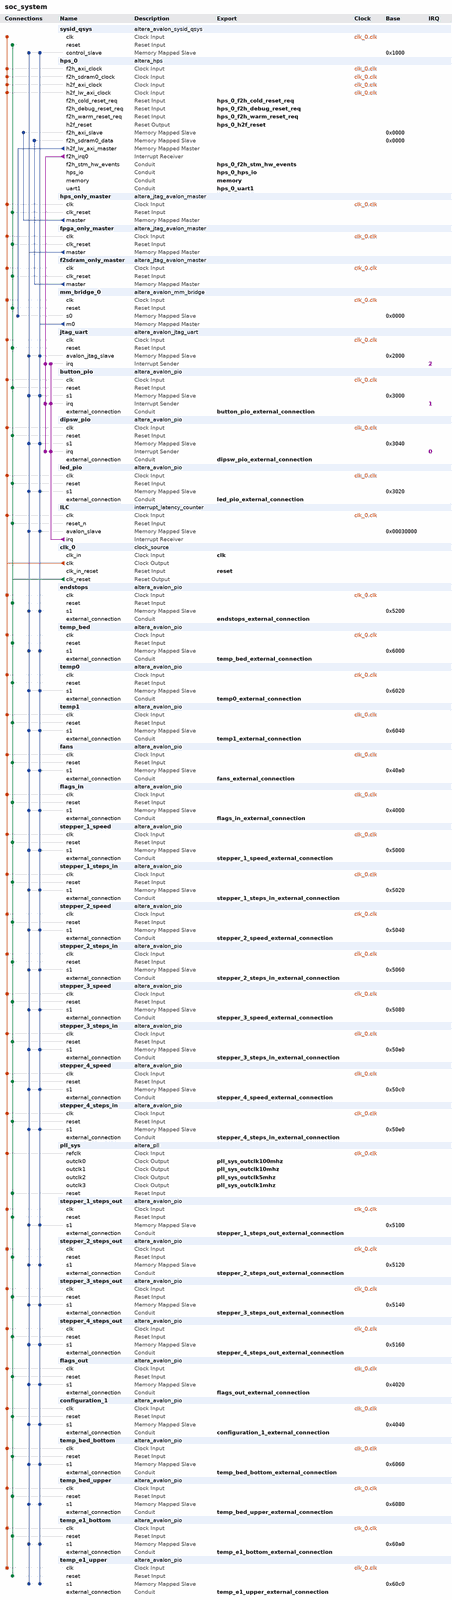
[diagram p0: system contents, whole]
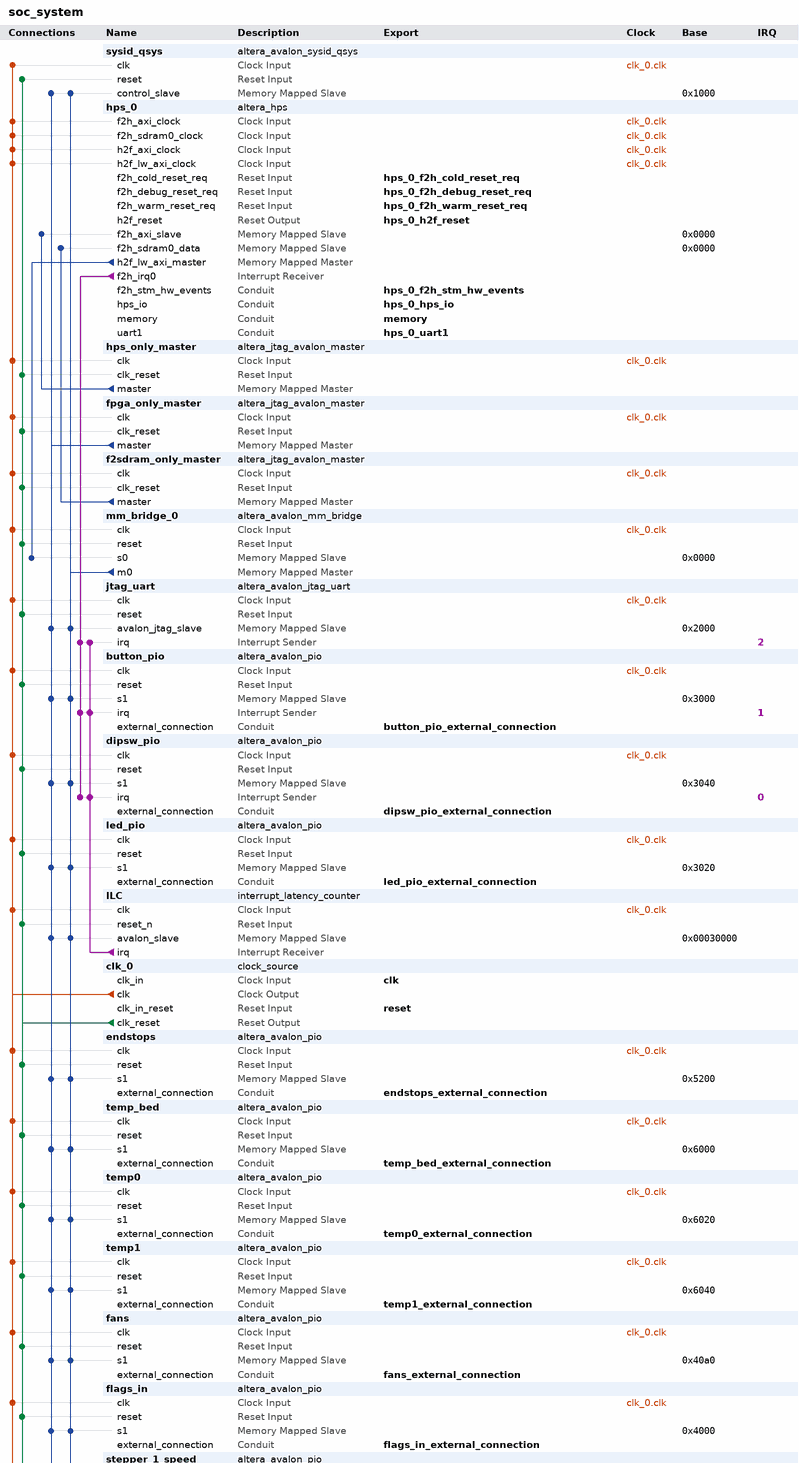
[diagram p1: system contents, upper part]
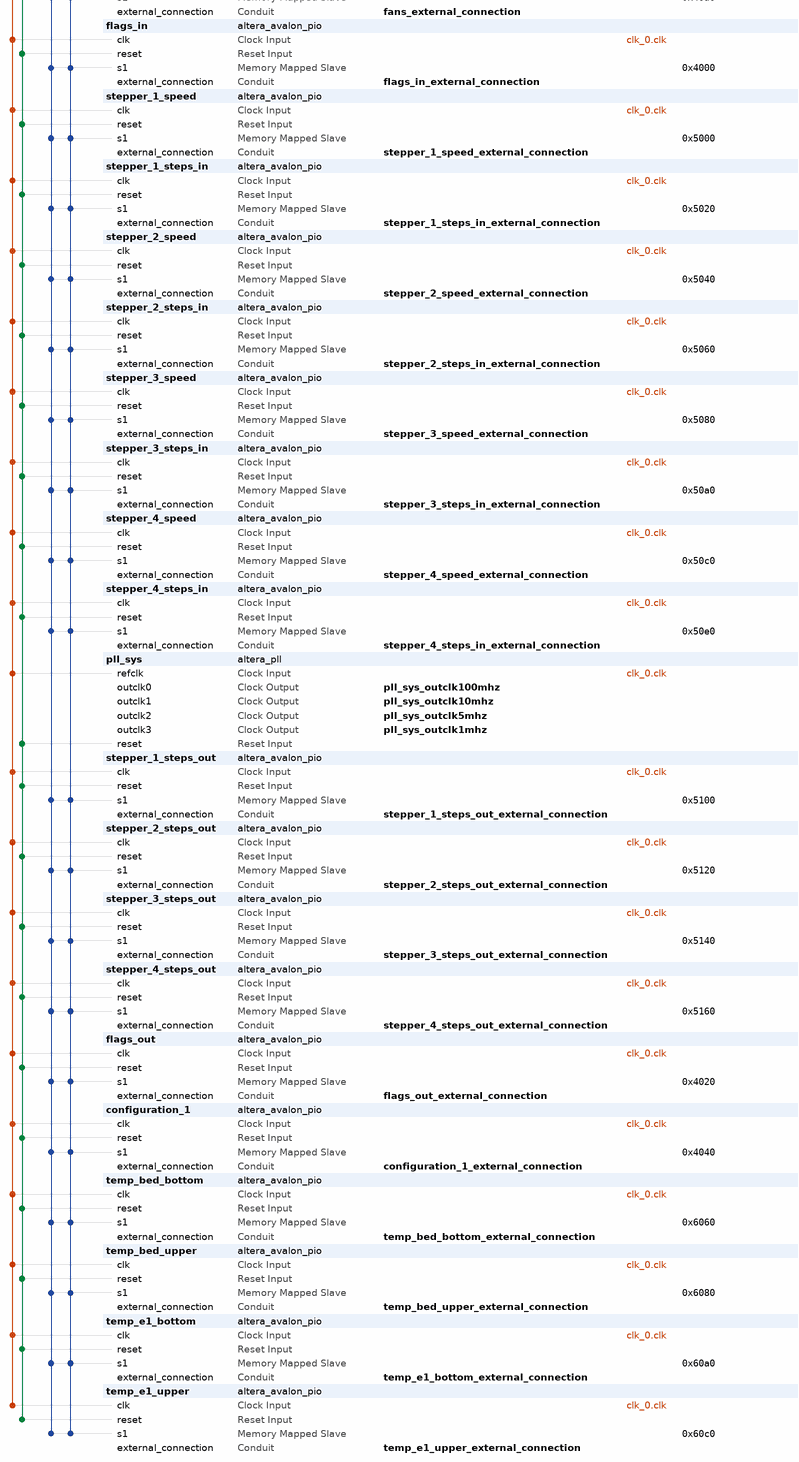
[diagram p2: system contents, lower part]
# Platform Designer (Qsys) system soc_system, Cyclone V 5CSEBA6U23I7
# Parameters at their usual value, and those the tool derives, are not listed.
package require -exact qsys 18.1
create_system soc_system
set_project_property DEVICE_FAMILY {Cyclone V}
set_project_property DEVICE 5CSEBA6U23I7

add_instance sysid_qsys altera_avalon_sysid_qsys 18.1
set_instance_parameter_value sysid_qsys id -60670

add_instance hps_0 altera_hps 18.1
set_instance_parameter_value hps_0 EMAC1_Mode RGMII
set_instance_parameter_value hps_0 EMAC1_PinMuxing {HPS I/O Set 0}
set_instance_parameter_value hps_0 F2SCLK_COLDRST_Enable true
set_instance_parameter_value hps_0 F2SCLK_DBGRST_Enable true
set_instance_parameter_value hps_0 F2SCLK_WARMRST_Enable true
set_instance_parameter_value hps_0 F2SDRAM_Type {Avalon-MM Bidirectional}
set_instance_parameter_value hps_0 F2SDRAM_Width 256
set_instance_parameter_value hps_0 F2SINTERRUPT_Enable true
set_instance_parameter_value hps_0 F2S_Width 2
set_instance_parameter_value hps_0 FPGA_PERIPHERAL_OUTPUT_CLOCK_FREQ_EMAC0_GTX_CLK 100
set_instance_parameter_value hps_0 FPGA_PERIPHERAL_OUTPUT_CLOCK_FREQ_EMAC0_MD_CLK 100.0
set_instance_parameter_value hps_0 FPGA_PERIPHERAL_OUTPUT_CLOCK_FREQ_EMAC1_GTX_CLK 100
set_instance_parameter_value hps_0 FPGA_PERIPHERAL_OUTPUT_CLOCK_FREQ_EMAC1_MD_CLK 100.0
set_instance_parameter_value hps_0 HPS_PROTOCOL DDR3
set_instance_parameter_value hps_0 I2C0_Mode I2C
set_instance_parameter_value hps_0 I2C0_PinMuxing {HPS I/O Set 0}
set_instance_parameter_value hps_0 I2C1_Mode I2C
set_instance_parameter_value hps_0 I2C1_PinMuxing {HPS I/O Set 0}
set_instance_parameter_value hps_0 LWH2F_Enable true
set_instance_parameter_value hps_0 MEM_BANKADDR_WIDTH 3
set_instance_parameter_value hps_0 MEM_CLK_FREQ 400.0
set_instance_parameter_value hps_0 MEM_COL_ADDR_WIDTH 10
set_instance_parameter_value hps_0 MEM_DQ_WIDTH 32
set_instance_parameter_value hps_0 MEM_DRV_STR RZQ/6
set_instance_parameter_value hps_0 MEM_ROW_ADDR_WIDTH 15
set_instance_parameter_value hps_0 MEM_RTT_NOM RZQ/6
set_instance_parameter_value hps_0 MEM_RTT_WR {Dynamic ODT off}
set_instance_parameter_value hps_0 MEM_TCL 7
set_instance_parameter_value hps_0 MEM_TFAW_NS 37.5
set_instance_parameter_value hps_0 MEM_TRAS_NS 35.0
set_instance_parameter_value hps_0 MEM_TRCD_NS 13.75
set_instance_parameter_value hps_0 MEM_TRFC_NS 300.0
set_instance_parameter_value hps_0 MEM_TRP_NS 13.75
set_instance_parameter_value hps_0 MEM_VENDOR Other
set_instance_parameter_value hps_0 MEM_WTCL 7
set_instance_parameter_value hps_0 QSPI_Mode N/A
set_instance_parameter_value hps_0 QSPI_PinMuxing Unused
set_instance_parameter_value hps_0 REF_CLK_FREQ 25.0
set_instance_parameter_value hps_0 S2FCLK_USER2CLK 4
set_instance_parameter_value hps_0 S2F_Width 2
set_instance_parameter_value hps_0 SDIO_Mode {4-bit Data}
set_instance_parameter_value hps_0 SDIO_PinMuxing {HPS I/O Set 0}
set_instance_parameter_value hps_0 SPIM1_Mode {Single Slave Select}
set_instance_parameter_value hps_0 SPIM1_PinMuxing {HPS I/O Set 0}
set_instance_parameter_value hps_0 STM_Enable true
set_instance_parameter_value hps_0 TIMING_BOARD_AC_SKEW 0.02
set_instance_parameter_value hps_0 TIMING_BOARD_AC_TO_CK_SKEW 0.0
set_instance_parameter_value hps_0 TIMING_BOARD_DQ_TO_DQS_SKEW 0.0
set_instance_parameter_value hps_0 TIMING_BOARD_MAX_CK_DELAY 0.6
set_instance_parameter_value hps_0 TIMING_BOARD_MAX_DQS_DELAY 0.6
set_instance_parameter_value hps_0 TIMING_BOARD_SKEW_BETWEEN_DQS 0.02
set_instance_parameter_value hps_0 TIMING_BOARD_SKEW_CKDQS_DIMM_MAX 0.01
set_instance_parameter_value hps_0 TIMING_BOARD_SKEW_CKDQS_DIMM_MIN -0.01
set_instance_parameter_value hps_0 TIMING_BOARD_SKEW_WITHIN_DQS 0.02
set_instance_parameter_value hps_0 TIMING_TDH 125
set_instance_parameter_value hps_0 TIMING_TDQSCK 400
set_instance_parameter_value hps_0 TIMING_TDQSQ 120
set_instance_parameter_value hps_0 TIMING_TDS 50
set_instance_parameter_value hps_0 TIMING_TIH 250
set_instance_parameter_value hps_0 TIMING_TIS 175
set_instance_parameter_value hps_0 TIMING_TQSH 0.38
set_instance_parameter_value hps_0 UART0_Mode {No Flow Control}
set_instance_parameter_value hps_0 UART0_PinMuxing {HPS I/O Set 0}
set_instance_parameter_value hps_0 UART1_Mode Full
set_instance_parameter_value hps_0 UART1_PinMuxing FPGA
set_instance_parameter_value hps_0 USB1_Mode SDR
set_instance_parameter_value hps_0 USB1_PinMuxing {HPS I/O Set 0}
set_instance_parameter_value hps_0 desired_cfg_clk_mhz 100.0
set_instance_parameter_value hps_0 desired_qspi_clk_mhz 370.0

add_instance hps_only_master altera_jtag_avalon_master 18.1

add_instance fpga_only_master altera_jtag_avalon_master 18.1

add_instance f2sdram_only_master altera_jtag_avalon_master 18.1

add_instance mm_bridge_0 altera_avalon_mm_bridge 18.1
set_instance_parameter_value mm_bridge_0 ADDRESS_UNITS SYMBOLS
set_instance_parameter_value mm_bridge_0 ADDRESS_WIDTH 10
set_instance_parameter_value mm_bridge_0 DATA_WIDTH 32
set_instance_parameter_value mm_bridge_0 MAX_PENDING_RESPONSES 4
set_instance_parameter_value mm_bridge_0 USE_AUTO_ADDRESS_WIDTH 1

add_instance jtag_uart altera_avalon_jtag_uart 18.1
set_instance_parameter_value jtag_uart allowMultipleConnections true
set_instance_parameter_value jtag_uart simInteractiveOptions INTERACTIVE_ASCII_OUTPUT

add_instance button_pio altera_avalon_pio 18.1
set_instance_parameter_value button_pio bitClearingEdgeCapReg true
set_instance_parameter_value button_pio captureEdge true
set_instance_parameter_value button_pio direction Input
set_instance_parameter_value button_pio edgeType FALLING
set_instance_parameter_value button_pio generateIRQ true
set_instance_parameter_value button_pio irqType EDGE
set_instance_parameter_value button_pio width 2

add_instance dipsw_pio altera_avalon_pio 18.1
set_instance_parameter_value dipsw_pio bitClearingEdgeCapReg true
set_instance_parameter_value dipsw_pio captureEdge true
set_instance_parameter_value dipsw_pio direction Input
set_instance_parameter_value dipsw_pio edgeType ANY
set_instance_parameter_value dipsw_pio generateIRQ true
set_instance_parameter_value dipsw_pio irqType EDGE
set_instance_parameter_value dipsw_pio width 4

add_instance led_pio altera_avalon_pio 18.1
set_instance_parameter_value led_pio direction Output
set_instance_parameter_value led_pio resetValue 127
set_instance_parameter_value led_pio width 7

add_instance ILC interrupt_latency_counter 18.1

add_instance clk_0 clock_source 18.1
set_instance_parameter_value clk_0 clockFrequency 50000000

add_instance endstops altera_avalon_pio 18.1
set_instance_parameter_value endstops direction Input
set_instance_parameter_value endstops width 6

add_instance temp_bed altera_avalon_pio 18.1
set_instance_parameter_value temp_bed direction Input
set_instance_parameter_value temp_bed width 12

add_instance temp0 altera_avalon_pio 18.1
set_instance_parameter_value temp0 direction Input
set_instance_parameter_value temp0 width 12

add_instance temp1 altera_avalon_pio 18.1
set_instance_parameter_value temp1 direction Input
set_instance_parameter_value temp1 width 12

add_instance fans altera_avalon_pio 18.1
set_instance_parameter_value fans direction Output
set_instance_parameter_value fans width 2

add_instance flags_in altera_avalon_pio 18.1
set_instance_parameter_value flags_in direction Input
set_instance_parameter_value flags_in width 32

add_instance stepper_1_speed altera_avalon_pio 18.1
set_instance_parameter_value stepper_1_speed direction Output
set_instance_parameter_value stepper_1_speed width 32

add_instance stepper_1_steps_in altera_avalon_pio 18.1
set_instance_parameter_value stepper_1_steps_in direction Input
set_instance_parameter_value stepper_1_steps_in width 32

add_instance stepper_2_speed altera_avalon_pio 18.1
set_instance_parameter_value stepper_2_speed direction Output
set_instance_parameter_value stepper_2_speed width 32

add_instance stepper_2_steps_in altera_avalon_pio 18.1
set_instance_parameter_value stepper_2_steps_in direction Input
set_instance_parameter_value stepper_2_steps_in width 32

add_instance stepper_3_speed altera_avalon_pio 18.1
set_instance_parameter_value stepper_3_speed direction Output
set_instance_parameter_value stepper_3_speed width 32

add_instance stepper_3_steps_in altera_avalon_pio 18.1
set_instance_parameter_value stepper_3_steps_in direction Input
set_instance_parameter_value stepper_3_steps_in width 32

add_instance stepper_4_speed altera_avalon_pio 18.1
set_instance_parameter_value stepper_4_speed direction Output
set_instance_parameter_value stepper_4_speed width 32

add_instance stepper_4_steps_in altera_avalon_pio 18.1
set_instance_parameter_value stepper_4_steps_in direction Input
set_instance_parameter_value stepper_4_steps_in width 32

add_instance pll_sys altera_pll 18.1
set_instance_parameter_value pll_sys gui_device_speed_grade 2
set_instance_parameter_value pll_sys gui_number_of_clocks 4
set_instance_parameter_value pll_sys gui_operation_mode direct
set_instance_parameter_value pll_sys gui_output_clock_frequency0 100.0
set_instance_parameter_value pll_sys gui_output_clock_frequency1 10.0
set_instance_parameter_value pll_sys gui_output_clock_frequency2 5.0
set_instance_parameter_value pll_sys gui_output_clock_frequency3 1.0
set_instance_parameter_value pll_sys gui_pll_mode {Integer-N PLL}
set_instance_parameter_value pll_sys gui_reference_clock_frequency 50.0
set_instance_parameter_value pll_sys gui_use_locked true

add_instance stepper_1_steps_out altera_avalon_pio 18.1
set_instance_parameter_value stepper_1_steps_out direction Output
set_instance_parameter_value stepper_1_steps_out width 32

add_instance stepper_2_steps_out altera_avalon_pio 18.1
set_instance_parameter_value stepper_2_steps_out direction Output
set_instance_parameter_value stepper_2_steps_out width 32

add_instance stepper_3_steps_out altera_avalon_pio 18.1
set_instance_parameter_value stepper_3_steps_out direction Output
set_instance_parameter_value stepper_3_steps_out width 32

add_instance stepper_4_steps_out altera_avalon_pio 18.1
set_instance_parameter_value stepper_4_steps_out direction Output
set_instance_parameter_value stepper_4_steps_out width 32

add_instance flags_out altera_avalon_pio 18.1
set_instance_parameter_value flags_out direction Output
set_instance_parameter_value flags_out width 32

add_instance configuration_1 altera_avalon_pio 18.1
set_instance_parameter_value configuration_1 direction Output
set_instance_parameter_value configuration_1 width 32

add_instance temp_bed_bottom altera_avalon_pio 18.1
set_instance_parameter_value temp_bed_bottom direction Output
set_instance_parameter_value temp_bed_bottom width 12

add_instance temp_bed_upper altera_avalon_pio 18.1
set_instance_parameter_value temp_bed_upper direction Output
set_instance_parameter_value temp_bed_upper width 12

add_instance temp_e1_bottom altera_avalon_pio 18.1
set_instance_parameter_value temp_e1_bottom direction Output
set_instance_parameter_value temp_e1_bottom width 12

add_instance temp_e1_upper altera_avalon_pio 18.1
set_instance_parameter_value temp_e1_upper direction Output
set_instance_parameter_value temp_e1_upper width 12

# connections
add_connection clk_0.clk button_pio.clk clock
add_connection clk_0.clk configuration_1.clk clock
add_connection clk_0.clk dipsw_pio.clk clock
add_connection clk_0.clk endstops.clk clock
add_connection clk_0.clk f2sdram_only_master.clk clock
add_connection clk_0.clk fans.clk clock
add_connection clk_0.clk flags_in.clk clock
add_connection clk_0.clk flags_out.clk clock
add_connection clk_0.clk fpga_only_master.clk clock
add_connection clk_0.clk hps_0.f2h_axi_clock clock
add_connection clk_0.clk hps_0.f2h_sdram0_clock clock
add_connection clk_0.clk hps_0.h2f_axi_clock clock
add_connection clk_0.clk hps_0.h2f_lw_axi_clock clock
add_connection clk_0.clk hps_only_master.clk clock
add_connection clk_0.clk ILC.clk clock
add_connection clk_0.clk jtag_uart.clk clock
add_connection clk_0.clk led_pio.clk clock
add_connection clk_0.clk mm_bridge_0.clk clock
add_connection clk_0.clk pll_sys.refclk clock
add_connection clk_0.clk stepper_1_speed.clk clock
add_connection clk_0.clk stepper_1_steps_in.clk clock
add_connection clk_0.clk stepper_1_steps_out.clk clock
add_connection clk_0.clk stepper_2_speed.clk clock
add_connection clk_0.clk stepper_2_steps_in.clk clock
add_connection clk_0.clk stepper_2_steps_out.clk clock
add_connection clk_0.clk stepper_3_speed.clk clock
add_connection clk_0.clk stepper_3_steps_in.clk clock
add_connection clk_0.clk stepper_3_steps_out.clk clock
add_connection clk_0.clk stepper_4_speed.clk clock
add_connection clk_0.clk stepper_4_steps_in.clk clock
add_connection clk_0.clk stepper_4_steps_out.clk clock
add_connection clk_0.clk sysid_qsys.clk clock
add_connection clk_0.clk temp0.clk clock
add_connection clk_0.clk temp1.clk clock
add_connection clk_0.clk temp_bed.clk clock
add_connection clk_0.clk temp_bed_bottom.clk clock
add_connection clk_0.clk temp_bed_upper.clk clock
add_connection clk_0.clk temp_e1_bottom.clk clock
add_connection clk_0.clk temp_e1_upper.clk clock
add_connection clk_0.clk_reset button_pio.reset reset
add_connection clk_0.clk_reset configuration_1.reset reset
add_connection clk_0.clk_reset dipsw_pio.reset reset
add_connection clk_0.clk_reset endstops.reset reset
add_connection clk_0.clk_reset f2sdram_only_master.clk_reset reset
add_connection clk_0.clk_reset fans.reset reset
add_connection clk_0.clk_reset flags_in.reset reset
add_connection clk_0.clk_reset flags_out.reset reset
add_connection clk_0.clk_reset fpga_only_master.clk_reset reset
add_connection clk_0.clk_reset hps_only_master.clk_reset reset
add_connection clk_0.clk_reset ILC.reset_n reset
add_connection clk_0.clk_reset jtag_uart.reset reset
add_connection clk_0.clk_reset led_pio.reset reset
add_connection clk_0.clk_reset mm_bridge_0.reset reset
add_connection clk_0.clk_reset pll_sys.reset reset
add_connection clk_0.clk_reset stepper_1_speed.reset reset
add_connection clk_0.clk_reset stepper_1_steps_in.reset reset
add_connection clk_0.clk_reset stepper_1_steps_out.reset reset
add_connection clk_0.clk_reset stepper_2_speed.reset reset
add_connection clk_0.clk_reset stepper_2_steps_in.reset reset
add_connection clk_0.clk_reset stepper_2_steps_out.reset reset
add_connection clk_0.clk_reset stepper_3_speed.reset reset
add_connection clk_0.clk_reset stepper_3_steps_in.reset reset
add_connection clk_0.clk_reset stepper_3_steps_out.reset reset
add_connection clk_0.clk_reset stepper_4_speed.reset reset
add_connection clk_0.clk_reset stepper_4_steps_in.reset reset
add_connection clk_0.clk_reset stepper_4_steps_out.reset reset
add_connection clk_0.clk_reset sysid_qsys.reset reset
add_connection clk_0.clk_reset temp0.reset reset
add_connection clk_0.clk_reset temp1.reset reset
add_connection clk_0.clk_reset temp_bed.reset reset
add_connection clk_0.clk_reset temp_bed_bottom.reset reset
add_connection clk_0.clk_reset temp_bed_upper.reset reset
add_connection clk_0.clk_reset temp_e1_bottom.reset reset
add_connection clk_0.clk_reset temp_e1_upper.reset reset
add_connection f2sdram_only_master.master hps_0.f2h_sdram0_data avalon
set_connection_parameter_value f2sdram_only_master.master/hps_0.f2h_sdram0_data baseAddress 0x0000
add_connection fpga_only_master.master button_pio.s1 avalon
set_connection_parameter_value fpga_only_master.master/button_pio.s1 baseAddress 0x3000
add_connection fpga_only_master.master configuration_1.s1 avalon
set_connection_parameter_value fpga_only_master.master/configuration_1.s1 baseAddress 0x4040
add_connection fpga_only_master.master dipsw_pio.s1 avalon
set_connection_parameter_value fpga_only_master.master/dipsw_pio.s1 baseAddress 0x3040
add_connection fpga_only_master.master endstops.s1 avalon
set_connection_parameter_value fpga_only_master.master/endstops.s1 baseAddress 0x5200
add_connection fpga_only_master.master fans.s1 avalon
set_connection_parameter_value fpga_only_master.master/fans.s1 baseAddress 0x40a0
add_connection fpga_only_master.master flags_in.s1 avalon
set_connection_parameter_value fpga_only_master.master/flags_in.s1 baseAddress 0x4000
add_connection fpga_only_master.master flags_out.s1 avalon
set_connection_parameter_value fpga_only_master.master/flags_out.s1 baseAddress 0x4020
add_connection fpga_only_master.master ILC.avalon_slave avalon
set_connection_parameter_value fpga_only_master.master/ILC.avalon_slave baseAddress 0x00030000
add_connection fpga_only_master.master jtag_uart.avalon_jtag_slave avalon
set_connection_parameter_value fpga_only_master.master/jtag_uart.avalon_jtag_slave baseAddress 0x2000
add_connection fpga_only_master.master led_pio.s1 avalon
set_connection_parameter_value fpga_only_master.master/led_pio.s1 baseAddress 0x3020
add_connection fpga_only_master.master stepper_1_speed.s1 avalon
set_connection_parameter_value fpga_only_master.master/stepper_1_speed.s1 baseAddress 0x5000
add_connection fpga_only_master.master stepper_1_steps_in.s1 avalon
set_connection_parameter_value fpga_only_master.master/stepper_1_steps_in.s1 baseAddress 0x5020
add_connection fpga_only_master.master stepper_1_steps_out.s1 avalon
set_connection_parameter_value fpga_only_master.master/stepper_1_steps_out.s1 baseAddress 0x5100
add_connection fpga_only_master.master stepper_2_speed.s1 avalon
set_connection_parameter_value fpga_only_master.master/stepper_2_speed.s1 baseAddress 0x5040
add_connection fpga_only_master.master stepper_2_steps_in.s1 avalon
set_connection_parameter_value fpga_only_master.master/stepper_2_steps_in.s1 baseAddress 0x5060
add_connection fpga_only_master.master stepper_2_steps_out.s1 avalon
set_connection_parameter_value fpga_only_master.master/stepper_2_steps_out.s1 baseAddress 0x5120
add_connection fpga_only_master.master stepper_3_speed.s1 avalon
set_connection_parameter_value fpga_only_master.master/stepper_3_speed.s1 baseAddress 0x5080
add_connection fpga_only_master.master stepper_3_steps_in.s1 avalon
set_connection_parameter_value fpga_only_master.master/stepper_3_steps_in.s1 baseAddress 0x50a0
add_connection fpga_only_master.master stepper_3_steps_out.s1 avalon
set_connection_parameter_value fpga_only_master.master/stepper_3_steps_out.s1 baseAddress 0x5140
add_connection fpga_only_master.master stepper_4_speed.s1 avalon
set_connection_parameter_value fpga_only_master.master/stepper_4_speed.s1 baseAddress 0x50c0
add_connection fpga_only_master.master stepper_4_steps_in.s1 avalon
set_connection_parameter_value fpga_only_master.master/stepper_4_steps_in.s1 baseAddress 0x50e0
add_connection fpga_only_master.master stepper_4_steps_out.s1 avalon
set_connection_parameter_value fpga_only_master.master/stepper_4_steps_out.s1 baseAddress 0x5160
add_connection fpga_only_master.master sysid_qsys.control_slave avalon
set_connection_parameter_value fpga_only_master.master/sysid_qsys.control_slave baseAddress 0x1000
add_connection fpga_only_master.master temp0.s1 avalon
set_connection_parameter_value fpga_only_master.master/temp0.s1 baseAddress 0x6020
add_connection fpga_only_master.master temp1.s1 avalon
set_connection_parameter_value fpga_only_master.master/temp1.s1 baseAddress 0x6040
add_connection fpga_only_master.master temp_bed.s1 avalon
set_connection_parameter_value fpga_only_master.master/temp_bed.s1 baseAddress 0x6000
add_connection fpga_only_master.master temp_bed_bottom.s1 avalon
set_connection_parameter_value fpga_only_master.master/temp_bed_bottom.s1 baseAddress 0x6060
add_connection fpga_only_master.master temp_bed_upper.s1 avalon
set_connection_parameter_value fpga_only_master.master/temp_bed_upper.s1 baseAddress 0x6080
add_connection fpga_only_master.master temp_e1_bottom.s1 avalon
set_connection_parameter_value fpga_only_master.master/temp_e1_bottom.s1 baseAddress 0x60a0
add_connection fpga_only_master.master temp_e1_upper.s1 avalon
set_connection_parameter_value fpga_only_master.master/temp_e1_upper.s1 baseAddress 0x60c0
add_connection hps_0.h2f_lw_axi_master mm_bridge_0.s0 avalon
set_connection_parameter_value hps_0.h2f_lw_axi_master/mm_bridge_0.s0 baseAddress 0x0000
add_connection hps_only_master.master hps_0.f2h_axi_slave avalon
set_connection_parameter_value hps_only_master.master/hps_0.f2h_axi_slave baseAddress 0x0000
add_connection mm_bridge_0.m0 button_pio.s1 avalon
set_connection_parameter_value mm_bridge_0.m0/button_pio.s1 baseAddress 0x3000
add_connection mm_bridge_0.m0 configuration_1.s1 avalon
set_connection_parameter_value mm_bridge_0.m0/configuration_1.s1 baseAddress 0x4040
add_connection mm_bridge_0.m0 dipsw_pio.s1 avalon
set_connection_parameter_value mm_bridge_0.m0/dipsw_pio.s1 baseAddress 0x3040
add_connection mm_bridge_0.m0 endstops.s1 avalon
set_connection_parameter_value mm_bridge_0.m0/endstops.s1 baseAddress 0x5200
add_connection mm_bridge_0.m0 fans.s1 avalon
set_connection_parameter_value mm_bridge_0.m0/fans.s1 baseAddress 0x40a0
add_connection mm_bridge_0.m0 flags_in.s1 avalon
set_connection_parameter_value mm_bridge_0.m0/flags_in.s1 baseAddress 0x4000
add_connection mm_bridge_0.m0 flags_out.s1 avalon
set_connection_parameter_value mm_bridge_0.m0/flags_out.s1 baseAddress 0x4020
add_connection mm_bridge_0.m0 ILC.avalon_slave avalon
set_connection_parameter_value mm_bridge_0.m0/ILC.avalon_slave baseAddress 0x00030000
add_connection mm_bridge_0.m0 jtag_uart.avalon_jtag_slave avalon
set_connection_parameter_value mm_bridge_0.m0/jtag_uart.avalon_jtag_slave baseAddress 0x2000
add_connection mm_bridge_0.m0 led_pio.s1 avalon
set_connection_parameter_value mm_bridge_0.m0/led_pio.s1 baseAddress 0x3020
add_connection mm_bridge_0.m0 stepper_1_speed.s1 avalon
set_connection_parameter_value mm_bridge_0.m0/stepper_1_speed.s1 baseAddress 0x5000
add_connection mm_bridge_0.m0 stepper_1_steps_in.s1 avalon
set_connection_parameter_value mm_bridge_0.m0/stepper_1_steps_in.s1 baseAddress 0x5020
add_connection mm_bridge_0.m0 stepper_1_steps_out.s1 avalon
set_connection_parameter_value mm_bridge_0.m0/stepper_1_steps_out.s1 baseAddress 0x5100
add_connection mm_bridge_0.m0 stepper_2_speed.s1 avalon
set_connection_parameter_value mm_bridge_0.m0/stepper_2_speed.s1 baseAddress 0x5040
add_connection mm_bridge_0.m0 stepper_2_steps_in.s1 avalon
set_connection_parameter_value mm_bridge_0.m0/stepper_2_steps_in.s1 baseAddress 0x5060
add_connection mm_bridge_0.m0 stepper_2_steps_out.s1 avalon
set_connection_parameter_value mm_bridge_0.m0/stepper_2_steps_out.s1 baseAddress 0x5120
add_connection mm_bridge_0.m0 stepper_3_speed.s1 avalon
set_connection_parameter_value mm_bridge_0.m0/stepper_3_speed.s1 baseAddress 0x5080
add_connection mm_bridge_0.m0 stepper_3_steps_in.s1 avalon
set_connection_parameter_value mm_bridge_0.m0/stepper_3_steps_in.s1 baseAddress 0x50a0
add_connection mm_bridge_0.m0 stepper_3_steps_out.s1 avalon
set_connection_parameter_value mm_bridge_0.m0/stepper_3_steps_out.s1 baseAddress 0x5140
add_connection mm_bridge_0.m0 stepper_4_speed.s1 avalon
set_connection_parameter_value mm_bridge_0.m0/stepper_4_speed.s1 baseAddress 0x50c0
add_connection mm_bridge_0.m0 stepper_4_steps_in.s1 avalon
set_connection_parameter_value mm_bridge_0.m0/stepper_4_steps_in.s1 baseAddress 0x50e0
add_connection mm_bridge_0.m0 stepper_4_steps_out.s1 avalon
set_connection_parameter_value mm_bridge_0.m0/stepper_4_steps_out.s1 baseAddress 0x5160
add_connection mm_bridge_0.m0 sysid_qsys.control_slave avalon
set_connection_parameter_value mm_bridge_0.m0/sysid_qsys.control_slave baseAddress 0x1000
add_connection mm_bridge_0.m0 temp0.s1 avalon
set_connection_parameter_value mm_bridge_0.m0/temp0.s1 baseAddress 0x6020
add_connection mm_bridge_0.m0 temp1.s1 avalon
set_connection_parameter_value mm_bridge_0.m0/temp1.s1 baseAddress 0x6040
add_connection mm_bridge_0.m0 temp_bed.s1 avalon
set_connection_parameter_value mm_bridge_0.m0/temp_bed.s1 baseAddress 0x6000
add_connection mm_bridge_0.m0 temp_bed_bottom.s1 avalon
set_connection_parameter_value mm_bridge_0.m0/temp_bed_bottom.s1 baseAddress 0x6060
add_connection mm_bridge_0.m0 temp_bed_upper.s1 avalon
set_connection_parameter_value mm_bridge_0.m0/temp_bed_upper.s1 baseAddress 0x6080
add_connection mm_bridge_0.m0 temp_e1_bottom.s1 avalon
set_connection_parameter_value mm_bridge_0.m0/temp_e1_bottom.s1 baseAddress 0x60a0
add_connection mm_bridge_0.m0 temp_e1_upper.s1 avalon
set_connection_parameter_value mm_bridge_0.m0/temp_e1_upper.s1 baseAddress 0x60c0
add_connection hps_0.f2h_irq0 button_pio.irq interrupt
set_connection_parameter_value hps_0.f2h_irq0/button_pio.irq irqNumber 1
add_connection hps_0.f2h_irq0 dipsw_pio.irq interrupt
set_connection_parameter_value hps_0.f2h_irq0/dipsw_pio.irq irqNumber 0
add_connection hps_0.f2h_irq0 jtag_uart.irq interrupt
set_connection_parameter_value hps_0.f2h_irq0/jtag_uart.irq irqNumber 2
add_connection ILC.irq button_pio.irq interrupt
set_connection_parameter_value ILC.irq/button_pio.irq irqNumber 1
add_connection ILC.irq dipsw_pio.irq interrupt
set_connection_parameter_value ILC.irq/dipsw_pio.irq irqNumber 0
add_connection ILC.irq jtag_uart.irq interrupt
set_connection_parameter_value ILC.irq/jtag_uart.irq irqNumber 2

# exported interfaces
add_interface button_pio_external_connection conduit end
set_interface_property button_pio_external_connection EXPORT_OF button_pio.external_connection
add_interface clk clock sink
set_interface_property clk EXPORT_OF clk_0.clk_in
add_interface configuration_1_external_connection conduit end
set_interface_property configuration_1_external_connection EXPORT_OF configuration_1.external_connection
add_interface dipsw_pio_external_connection conduit end
set_interface_property dipsw_pio_external_connection EXPORT_OF dipsw_pio.external_connection
add_interface endstops_external_connection conduit end
set_interface_property endstops_external_connection EXPORT_OF endstops.external_connection
add_interface fans_external_connection conduit end
set_interface_property fans_external_connection EXPORT_OF fans.external_connection
add_interface flags_in_external_connection conduit end
set_interface_property flags_in_external_connection EXPORT_OF flags_in.external_connection
add_interface flags_out_external_connection conduit end
set_interface_property flags_out_external_connection EXPORT_OF flags_out.external_connection
add_interface hps_0_f2h_cold_reset_req reset sink
set_interface_property hps_0_f2h_cold_reset_req EXPORT_OF hps_0.f2h_cold_reset_req
add_interface hps_0_f2h_debug_reset_req reset sink
set_interface_property hps_0_f2h_debug_reset_req EXPORT_OF hps_0.f2h_debug_reset_req
add_interface hps_0_f2h_stm_hw_events conduit end
set_interface_property hps_0_f2h_stm_hw_events EXPORT_OF hps_0.f2h_stm_hw_events
add_interface hps_0_f2h_warm_reset_req reset sink
set_interface_property hps_0_f2h_warm_reset_req EXPORT_OF hps_0.f2h_warm_reset_req
add_interface hps_0_h2f_reset reset source
set_interface_property hps_0_h2f_reset EXPORT_OF hps_0.h2f_reset
add_interface hps_0_hps_io conduit end
set_interface_property hps_0_hps_io EXPORT_OF hps_0.hps_io
add_interface hps_0_uart1 conduit end
set_interface_property hps_0_uart1 EXPORT_OF hps_0.uart1
add_interface led_pio_external_connection conduit end
set_interface_property led_pio_external_connection EXPORT_OF led_pio.external_connection
add_interface memory conduit end
set_interface_property memory EXPORT_OF hps_0.memory
add_interface pll_sys_outclk100mhz clock source
set_interface_property pll_sys_outclk100mhz EXPORT_OF pll_sys.outclk0
add_interface pll_sys_outclk10mhz clock source
set_interface_property pll_sys_outclk10mhz EXPORT_OF pll_sys.outclk1
add_interface pll_sys_outclk1mhz clock source
set_interface_property pll_sys_outclk1mhz EXPORT_OF pll_sys.outclk3
add_interface pll_sys_outclk5mhz clock source
set_interface_property pll_sys_outclk5mhz EXPORT_OF pll_sys.outclk2
add_interface reset reset sink
set_interface_property reset EXPORT_OF clk_0.clk_in_reset
add_interface stepper_1_speed_external_connection conduit end
set_interface_property stepper_1_speed_external_connection EXPORT_OF stepper_1_speed.external_connection
add_interface stepper_1_steps_in_external_connection conduit end
set_interface_property stepper_1_steps_in_external_connection EXPORT_OF stepper_1_steps_in.external_connection
add_interface stepper_1_steps_out_external_connection conduit end
set_interface_property stepper_1_steps_out_external_connection EXPORT_OF stepper_1_steps_out.external_connection
add_interface stepper_2_speed_external_connection conduit end
set_interface_property stepper_2_speed_external_connection EXPORT_OF stepper_2_speed.external_connection
add_interface stepper_2_steps_in_external_connection conduit end
set_interface_property stepper_2_steps_in_external_connection EXPORT_OF stepper_2_steps_in.external_connection
add_interface stepper_2_steps_out_external_connection conduit end
set_interface_property stepper_2_steps_out_external_connection EXPORT_OF stepper_2_steps_out.external_connection
add_interface stepper_3_speed_external_connection conduit end
set_interface_property stepper_3_speed_external_connection EXPORT_OF stepper_3_speed.external_connection
add_interface stepper_3_steps_in_external_connection conduit end
set_interface_property stepper_3_steps_in_external_connection EXPORT_OF stepper_3_steps_in.external_connection
add_interface stepper_3_steps_out_external_connection conduit end
set_interface_property stepper_3_steps_out_external_connection EXPORT_OF stepper_3_steps_out.external_connection
add_interface stepper_4_speed_external_connection conduit end
set_interface_property stepper_4_speed_external_connection EXPORT_OF stepper_4_speed.external_connection
add_interface stepper_4_steps_in_external_connection conduit end
set_interface_property stepper_4_steps_in_external_connection EXPORT_OF stepper_4_steps_in.external_connection
add_interface stepper_4_steps_out_external_connection conduit end
set_interface_property stepper_4_steps_out_external_connection EXPORT_OF stepper_4_steps_out.external_connection
add_interface temp0_external_connection conduit end
set_interface_property temp0_external_connection EXPORT_OF temp0.external_connection
add_interface temp1_external_connection conduit end
set_interface_property temp1_external_connection EXPORT_OF temp1.external_connection
add_interface temp_bed_bottom_external_connection conduit end
set_interface_property temp_bed_bottom_external_connection EXPORT_OF temp_bed_bottom.external_connection
add_interface temp_bed_external_connection conduit end
set_interface_property temp_bed_external_connection EXPORT_OF temp_bed.external_connection
add_interface temp_bed_upper_external_connection conduit end
set_interface_property temp_bed_upper_external_connection EXPORT_OF temp_bed_upper.external_connection
add_interface temp_e1_bottom_external_connection conduit end
set_interface_property temp_e1_bottom_external_connection EXPORT_OF temp_e1_bottom.external_connection
add_interface temp_e1_upper_external_connection conduit end
set_interface_property temp_e1_upper_external_connection EXPORT_OF temp_e1_upper.external_connection

set_interconnect_requirement {$system} qsys_mm.clockCrossingAdapter HANDSHAKE
set_interconnect_requirement {$system} qsys_mm.maxAdditionalLatency 1

save_system soc_system.qsys
